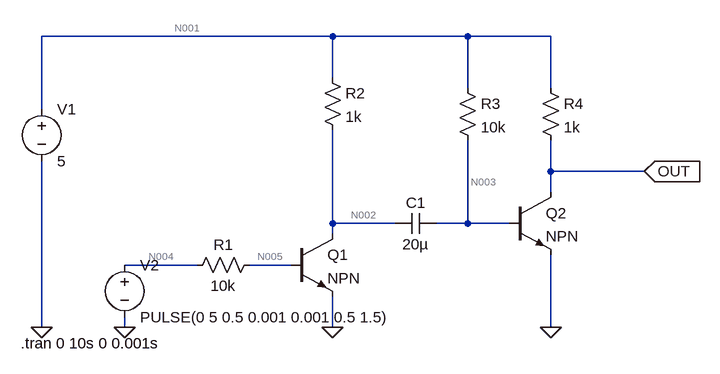
[diagram p0: schematic schemat.asc]
schemat.asc, the LTspice schematic file:
Version 4
SHEET 1 880 680
WIRE 112 16 -336 16
WIRE 320 16 112 16
WIRE 448 16 320 16
WIRE 112 80 112 16
WIRE 320 96 320 16
WIRE 448 96 448 16
WIRE -336 128 -336 16
WIRE 448 224 448 176
WIRE 592 224 448 224
WIRE 448 256 448 224
WIRE 112 304 112 160
WIRE 208 304 112 304
WIRE 320 304 320 176
WIRE 320 304 272 304
WIRE 384 304 320 304
WIRE 112 320 112 304
WIRE -96 368 -208 368
WIRE 48 368 -16 368
WIRE -336 464 -336 208
WIRE -208 464 -208 448
WIRE 112 464 112 416
WIRE 448 464 448 352
FLAG 592 224 OUT
IOPIN 592 224 In
FLAG -208 464 0
FLAG -336 464 0
FLAG 112 464 0
FLAG 448 464 0
SYMBOL voltage -336 112 R0
WINDOW 123 0 0 Left 0
WINDOW 39 0 0 Left 0
SYMATTR InstName V1
SYMATTR Value 5
SYMBOL res 96 64 R0
SYMATTR InstName R2
SYMATTR Value 1k
SYMBOL res 432 80 R0
SYMATTR InstName R4
SYMATTR Value 1k
SYMBOL npn 48 320 R0
SYMATTR InstName Q1
SYMBOL npn 384 256 R0
SYMATTR InstName Q2
SYMBOL cap 272 288 R90
WINDOW 0 0 32 VBottom 2
WINDOW 3 32 32 VTop 2
SYMATTR InstName C1
SYMATTR Value 20µ
SYMBOL res 0 352 R90
WINDOW 0 0 56 VBottom 2
WINDOW 3 32 56 VTop 2
SYMATTR InstName R1
SYMATTR Value 10k
SYMBOL res 304 80 R0
SYMATTR InstName R3
SYMATTR Value 10k
SYMBOL voltage -208 352 R0
WINDOW 123 0 0 Left 0
WINDOW 39 0 0 Left 0
SYMATTR InstName V2
SYMATTR Value PULSE(0 5 0.5 0.001 0.001 0.5 1.5)
TEXT -368 488 Left 2 !.tran 0 10s 0 0.001s

The netlist it stands for:
* schemat.asc
V1 N001 0 5
R2 N001 N002 1k
R4 N001 OUT 1k
Q1 N002 N005 0 0 NPN
Q2 OUT N003 0 0 NPN
C1 N003 N002 20µ
R1 N005 N004 10k
R3 N001 N003 10k
V2 N004 0 PULSE(0 5 0.5 0.001 0.001 0.5 1.5)
.model NPN NPN
.model PNP PNP
.lib standard.bjt
.tran 0 10s 0 0.001s
.backanno
.end

* Results of the author's LTspice run, read from the files saved beside the schematic
* Operating Point, zero values left out:
*   V(n001) = 5 V
*   V(n002) = 5 V
*   V(out) = 71.11 mV
*   V(n005) = 50 nV
*   V(n003) = 819 mV
*   Ic(Q1) = 5 pA
*   Ib(Q1) = -5 pA
*   Ic(Q2) = 4.929 mA
*   Ib(Q2) = 418.1 µA
*   Ie(Q2) = -5.347 mA
*   I(R2) = 5 pA
*   I(R4) = 4.929 mA
*   I(R1) = 5 pA
*   I(R3) = 418.1 µA
*   I(V1) = -5.347 mA
*   I(V2) = 5 pA
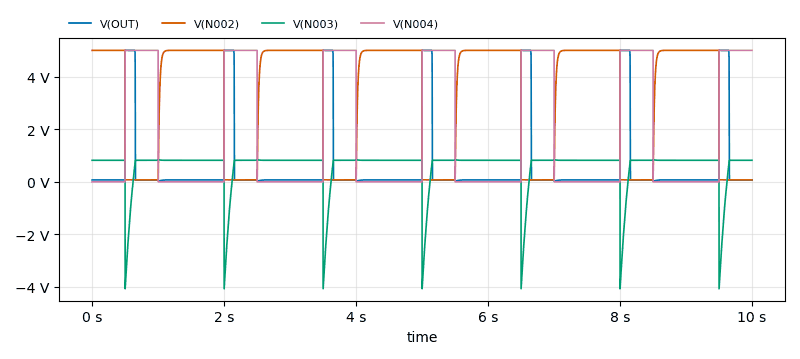
[diagram p1: Transient Analysis of schemat.asc, plotted from the saved traces]
* Transient Analysis, 1 run:
*   V(OUT): min 28.21 mV, max 5 V, average 602.7 mV, rms 1.641 V, last 71.11 mV
*   V(N002): min 71.05 mV, max 5 V, average 3.212 V, rms 3.973 V, last 71.11 mV
*   V(N003): min -4.07 V, max 844.5 mV, average 583.9 mV, rms 1.018 V, last 819 mV
*   V(N004): min 0 V, max 5 V, average 1.753 V, rms 2.96 V, last 5 V